# EAGLE design flexino (EAGLE 7.2.0)
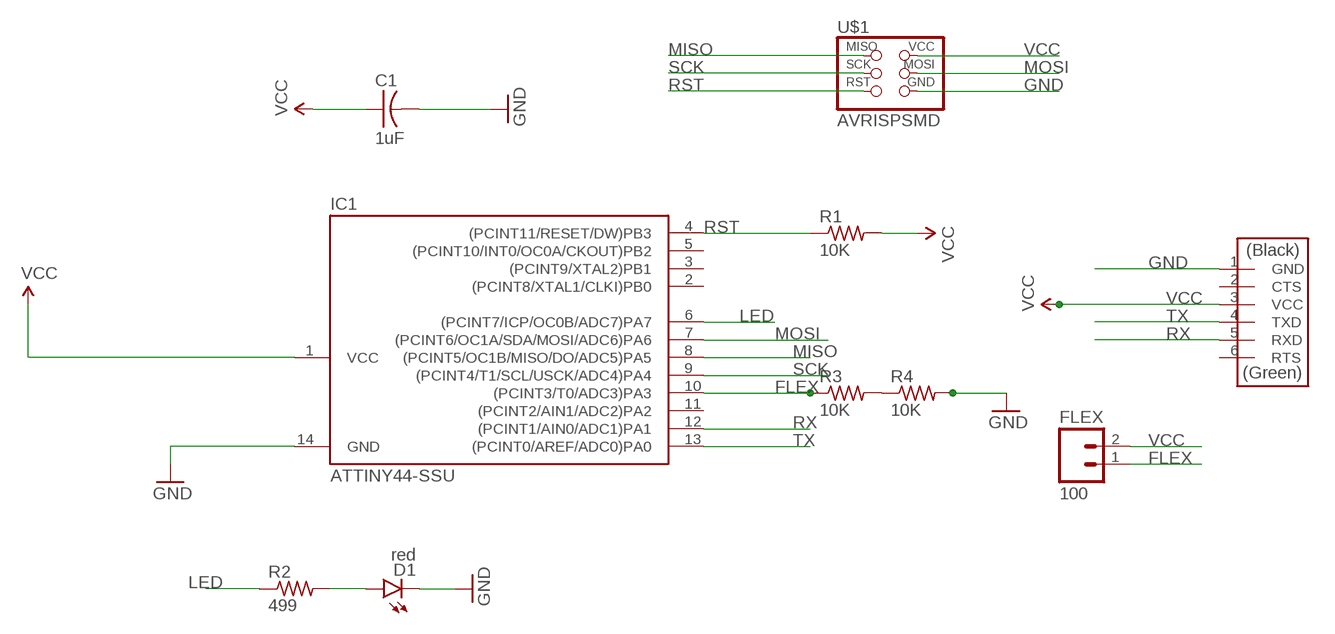
[diagram p0: schematic, sheet 1]

## Parts
C1  1uF  CAP-US1206FAB  [C1206FAB]
D1  red  LED1206  [LED-1206]
FLEX  100  M02PTH3  [1X02_LONGPADS]
IC1  ATTINY44-SSU  [SOIC14]
R1  10K  RES-US1206W  [R1206W]
R2  499  RES-US1206W  [R1206W]
R3  10K  RES-US1206W  [R1206W]
R4  10K  RES-US1206W  [R1206W]
U$1  AVRISPSMD  [2X03SMD]
U$2  FTDI-SMD-HEADER  [1X06SMD]

## Nets
FLEX: FLEX.1 IC1.10((PCINT3/T0/ADC3)PA3) R3.1
GND: C1.2 D1.C IC1.14(GND) R4.2 U$1.6(GND) U$2.1(GND)
LED: IC1.6((PCINT7/ICP/OC0B/ADC7)PA7) R2.1
MISO: IC1.8((PCINT5/OC1B/MISO/DO/ADC5)PA5) U$1.1(MISO)
MOSI: IC1.7((PCINT6/OC1A/SDA/MOSI/ADC6)PA6) U$1.4(MOSI)
N$1: D1.A R2.2
N$2: R3.2 R4.1
RST: IC1.4((PCINT11/RESET/DW)PB3) R1.1 U$1.5(RST)
RX: IC1.12((PCINT1/AIN0/ADC1)PA1) U$2.5(RXD)
SCK: IC1.9((PCINT4/T1/SCL/USCK/ADC4)PA4) U$1.3(SCK)
TX: IC1.13((PCINT0/AREF/ADC0)PA0) U$2.4(TXD)
VCC: C1.1 FLEX.2 IC1.1(VCC) R1.2 U$1.2(VCC) U$2.3(VCC)
Unconnected: IC1.2((PCINT8/XTAL1/CLKI)PB0) IC1.3((PCINT9/XTAL2)PB1) IC1.5((PCINT10/INT0/OC0A/CKOUT)PB2) IC1.11((PCINT2/AIN1/ADC2)PA2) U$2.2(CTS) U$2.6(RTS)

## Library data of the parts
C1 = fab:CAP-US
D1 = SparkFun-LED:LED: LEDs Standard schematic elements and footprints for 5mm, 3mm, 1206, and 0603 sized LEDs. 5mm - Spark Fun Electronics SKU : COM-00529 (and others)
FLEX = SparkFun-Connectors:M02: Standard 2-pin 0.1" header. Use with - straight break away headers ( PRT-00116) - right angle break away headers (PRT-00553) - swiss pins (PRT-00743) - machine pins (PRT-00117) - female headers (PRT-00115) Molex polarized connector foot print use with: PRT-08233 with associated crimp pins and housings. 2.54_SCREWTERM for use with PRT-10571. 3.5mm Screw Terminal footprints for PRT-08084 5mm Screw Terminal footprints for use with PRT-08432
IC1 = fab:ATTINY44
R1-R4 = fab:RES-US: Resistor (US Symbol) Variants with postfix FAB are widened to allow the routing of internal traces
U$1 = fab:AVRISP
U$2 = fab:FTDI-SMD-HEADER

## Board
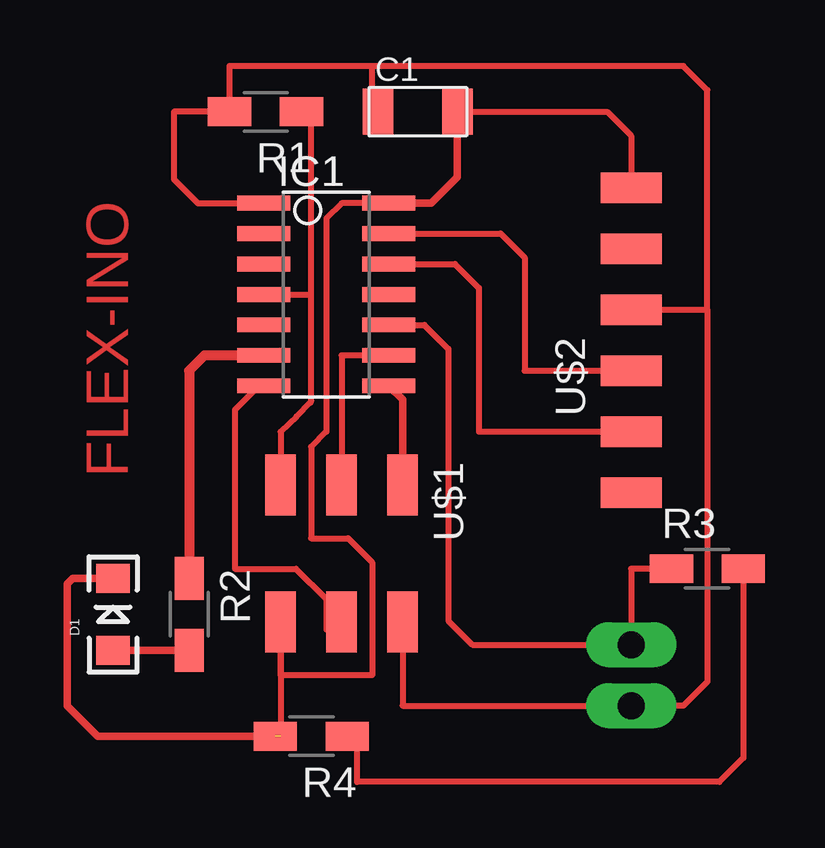
[diagram p1: board, top side]

No outline drawn. Coordinates in mm, seen from the top.
Copper layers (1*16): Top 0.035mm / dielectric 1.5mm / Bottom 0.035mm
Design rules "default": minimum track width 10mil, minimum drill 24mil, track to track 8mil, track to pad 8mil, pad to pad 8mil, via to via 8mil, smd to smd 8mil, copper to edge 40mil, drill to drill 8mil, minimum pad ring 10mil, minimum via ring 8mil, stop-mask expansion 4mil, vias tented up to drill 0mil, thermal gap 10mil

### Footprints (pad centres in the part's own frame; a part is rotated, then mirrored left to right if it is on the bottom)
C1206FAB = smd 1.27 x 1.905: 1 -1.651,0; 2 1.651,0
LED-1206 = smd 1.2 x 1.4: A -1.5,0; C 1.5,0
1X02_LONGPADS = drill 1.118 pad 1.88 long: 1 0,0; 2 2.54,0
SOIC14 = smd 0.61 x 2.21: 1 -3.81,-2.603; 2 -2.54,-2.603; 3 -1.27,-2.603; 4 0,-2.603; 5 1.27,-2.603; 6 2.54,-2.603; 7 3.81,-2.603; 8 3.81,2.603; 9 2.54,2.603; 10 1.27,2.603; 11 0,2.603; 12 -1.27,2.603; 13 -2.54,2.603; 14 -3.81,2.603
R1206W = smd 1.8 x 1.2: 1 -1.499,0; 2 1.499,0
2X03SMD = smd 2.54 x 1.27: 1 -2.857,2.54; 2 2.857,2.54; 3 -2.857,0; 4 2.857,0; 5 -2.857,-2.54; 6 2.857,-2.54
1X06SMD = smd 2.54 x 1.27: 1 0,6.35; 2 0,3.81; 3 0,1.27; 4 0,-1.27; 5 0,-3.81; 6 0,-6.35

### Placement (x,y rotation side)
C1  80.01,69.85 0 top
D1  67.31,48.9 90 top
FLEX  88.9,47.62 270 top
IC1  76.2,62.23 270 top
R1  73.66,69.85 180 top
R2  70.48,48.9 270 top
R3  92.08,50.8 0 top
R4  75.56,43.81 180 top
U$1  76.83,51.44 270 top
U$2  88.9,60.33 0 top

### Tracks (layer width: path | path; a pad name or v marks a point on that pad's centre or on a via)
FLEX
  Top 0.254: IC1.10 80.28,60.96 81.28,59.96 81.28,48.62 82.28,47.62 FLEX.1 88.9,50.8 R3.1
GND  (1 unrouted)
  Top 0.254: C1.2 87.9,69.85 88.9,68.85 U$2.1 | IC1.14 76.83,66.04 76.2,65.41 76.2,56.52 75.56,55.88 75.56,52.07 77.11,52.07 78.11,51.07 78.11,46.35 74.3,46.35 U$1.6 74.3,43.81
  Top 0.305: IC1.14 80.57,66.04 81.66,67.13 C1.2 | R4.2 66.67,43.81 65.41,45.09 65.41,50.16 65.64,50.4 D1.C
LED
  Top 0.406: IC1.6 71.12,59.69 70.48,59.05 R2.1
MISO
  Top 0.305: IC1.8 79.38,57.85 U$1.1
MOSI
  Top 0.254: IC1.7 73.39,58.42 72.39,57.42 72.39,50.8 74.93,50.8 76.2,49.53 76.2,48.26 76.52,48.26 U$1.4
N$1
  Top 0.305: R2.2 D1.A
N$2
  Top 0.254: R4.1 77.47,43.81 77.47,41.91 92.57,41.91 93.57,42.91 R3.2
RST
  Top 0.254: 75.56,62.23 75.56,57.86 75.53,57.72 74.96,57.15 74.3,56.52 U$1.5 | 75.56,62.23 75.56,69.44 | IC1.4 75.56,62.23
  Top 0.305: 75.56,69.85 75.56,69.44 R1.1
RX
  Top 0.254: IC1.12 81.55,63.5 82.55,62.5 82.55,56.52 U$2.5
SCK
  Top 0.254: IC1.9 76.83,59.69 U$1.3
TX
  Top 0.254: IC1.13 83.45,64.77 84.45,63.77 84.45,59.05 U$2.4
VCC
  Top 0.254: IC1.1 70.85,66.04 69.85,67.04 69.85,69.85 R1.2 72.16,71.75 78.11,71.75 | C1.1 78.11,69.85 78.11,71.75 | 92.08,61.59 92.08,70.75 91.08,71.75 78.11,71.75 | 79.38,48.9 U$1.2 79.38,45.09 FLEX.2 91.08,45.09 92.08,46.09 92.08,61.59 | U$2.3 92.08,61.59

### Text on the board
Top: FLEX-INO